# EasyEDA schematic MagicSwitchboard.json
TITLE: Magic Switchboard (arduino-nano); REV: 1.0; Date: 2018-10-23; Sheet: 1/1; Drawn By: RincewindWizzard
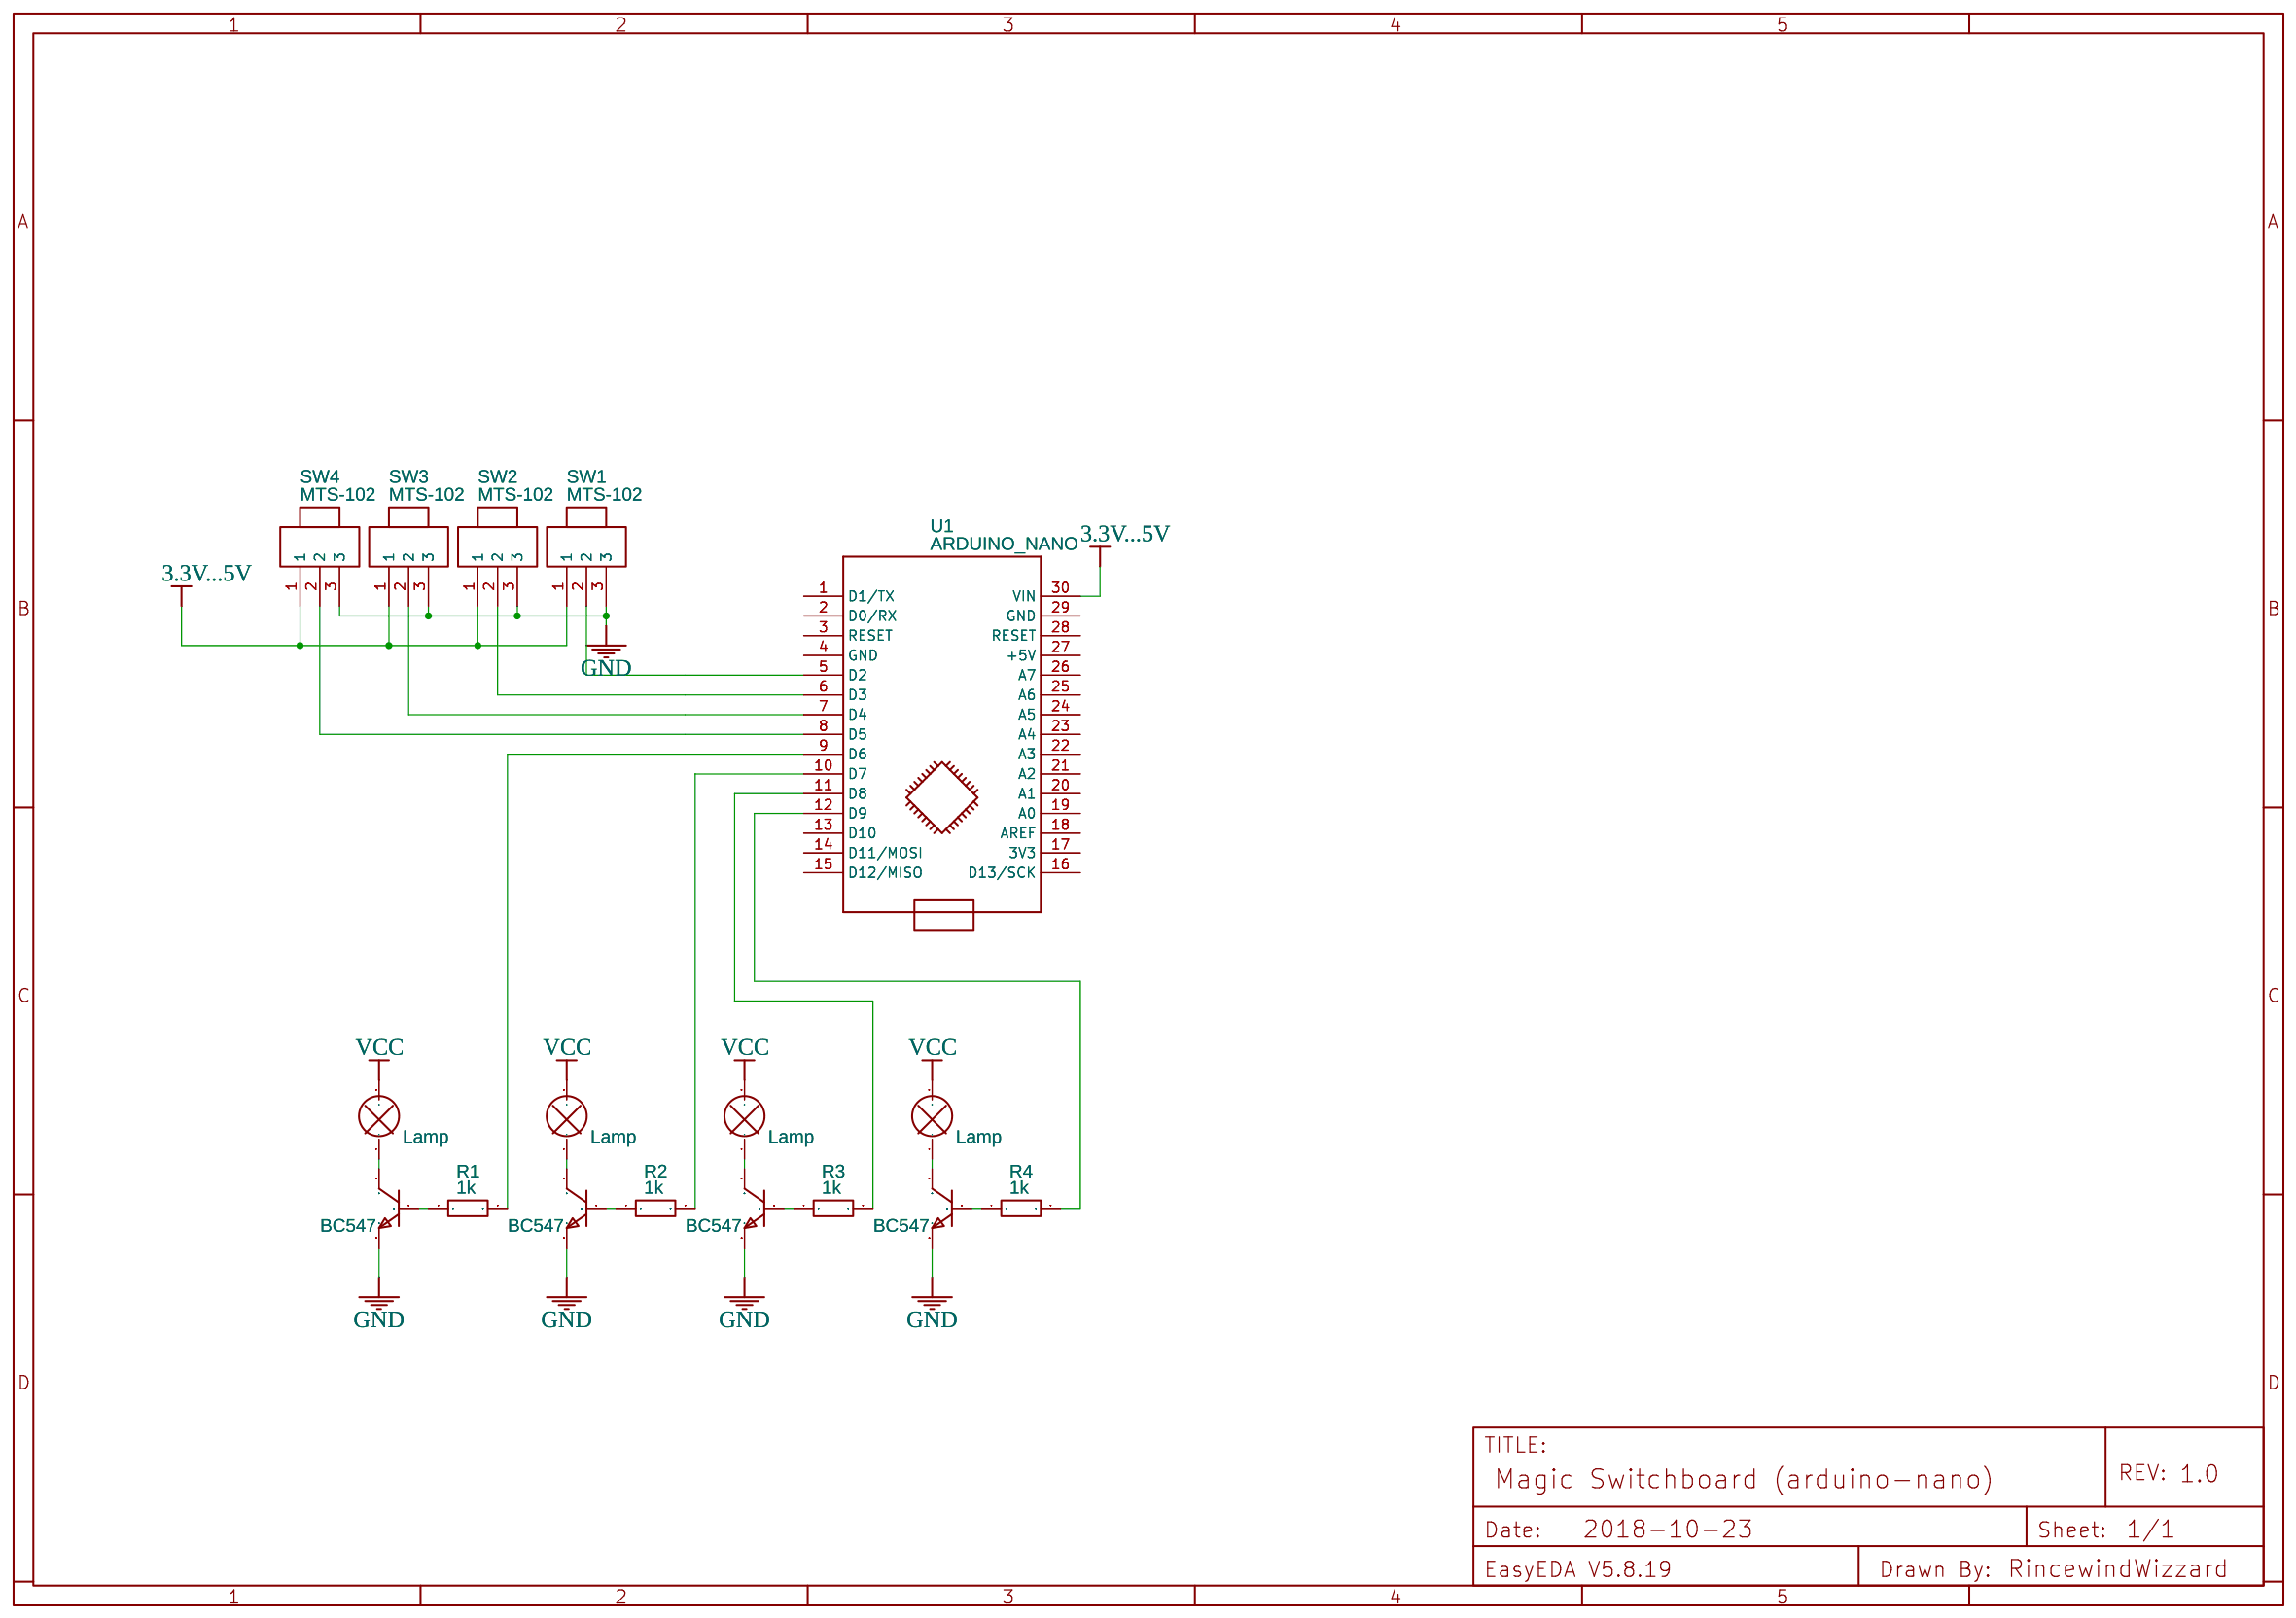
[diagram p0: schematic sheet]

## Parts
LA1  Lamp
LA2  Lamp
LA3  Lamp
LA4  Lamp
Q1  BC547  [TO-92(TO-92-3)]
Q2  BC547  [TO-92(TO-92-3)]
Q3  BC547  [TO-92(TO-92-3)]
Q5  BC547  [TO-92(TO-92-3)]
R1  1k  [AXIAL-0.3]
R2  1k  [AXIAL-0.3]
R3  1k  [AXIAL-0.3]
R4  1k  [AXIAL-0.3]
SW1  MTS-102  [MTS-102]
SW2  MTS-102  [MTS-102]
SW3  MTS-102  [MTS-102]
SW4  MTS-102  [MTS-102]
U1  ARDUINO_NANO  [ARDUINO_NANO]

## Library data of the parts
LA1-LA4 = -: Contributor: KiCAD; license: https://www.gnu.org/licenses/lgpl-2.1.html; Manufacturer Part: ?
Q1-Q3 Q5 = -: Supplier: LCSC; Manufacturer: CJ; Manufacturer Part: BC547B Tube; image: //image.lceda.cn/szlcsc/C2092.jpg; Contributor: LCSC; Supplier Part: C2092
R1-R4 = Res_AXIAL-0.3(1/8W)_EU: Manufacturer Part: ?
SW1-SW4 = -: Supplier: LCSC; Manufacturer: BBJ; Manufacturer Part: Rocker switch601-10211BB; image: //image.lceda.cn/szlcsc/C67849.jpg; Contributor: Thoughtyness; Supplier Part: C67849
U1 = -: sourceId: KGSeAWhDB; Manufacturer Part: ?

## Nets
3.3V...5V: SW1.1 SW2.1 SW3.1 SW4.1 U1.30(VIN)
GND: Q1.3(E) Q2.3(E) Q3.3(E) Q5.3(E) SW1.3 SW2.3 SW3.3 SW4.3
VCC: LA1.2(+) LA2.2(+) LA3.2(+) LA4.2(+)
Net-(LA1-1): LA1.1(-) Q5.1(C)
Net-(LA2-1): LA2.1(-) Q1.1(C)
Net-(LA3-1): LA3.1(-) Q2.1(C)
Net-(LA4-1): LA4.1(-) Q3.1(C)
Net-(Q1-2): Q1.2(B) R2.1
Net-(Q2-2): Q2.2(B) R3.1
Net-(Q3-2): Q3.2(B) R4.1
Net-(Q5-2): Q5.2(B) R1.1
Net-(R1-2): R1.2 U1.9(D6)
Net-(R2-2): R2.2 U1.10(D7)
Net-(R3-2): R3.2 U1.11(D8)
Net-(R4-2): R4.2 U1.12(D9)
Net-(SW1-2): SW1.2 U1.5(D2)
Net-(SW2-2): SW2.2 U1.6(D3)
Net-(SW3-2): SW3.2 U1.7(D4)
Net-(SW4-2): SW4.2 U1.8(D5)

Not connected (* = marked no-connect by the designer): U1 1(D1/TX) 2(D0/RX) 3(RESET) 4(GND) 13(D10) 14(D11/MOSI) 15(D12/MISO) 16(D13/SCK) 17(3V3) 18(AREF) 19(A0) 20(A1) 21(A2) 22(A3) 23(A4) 24(A5) 25(A6) 26(A7) 27(+5V) 28(RESET) 29(GND)
